# EAGLE design tinyogx360 (EAGLE 9.6.2)
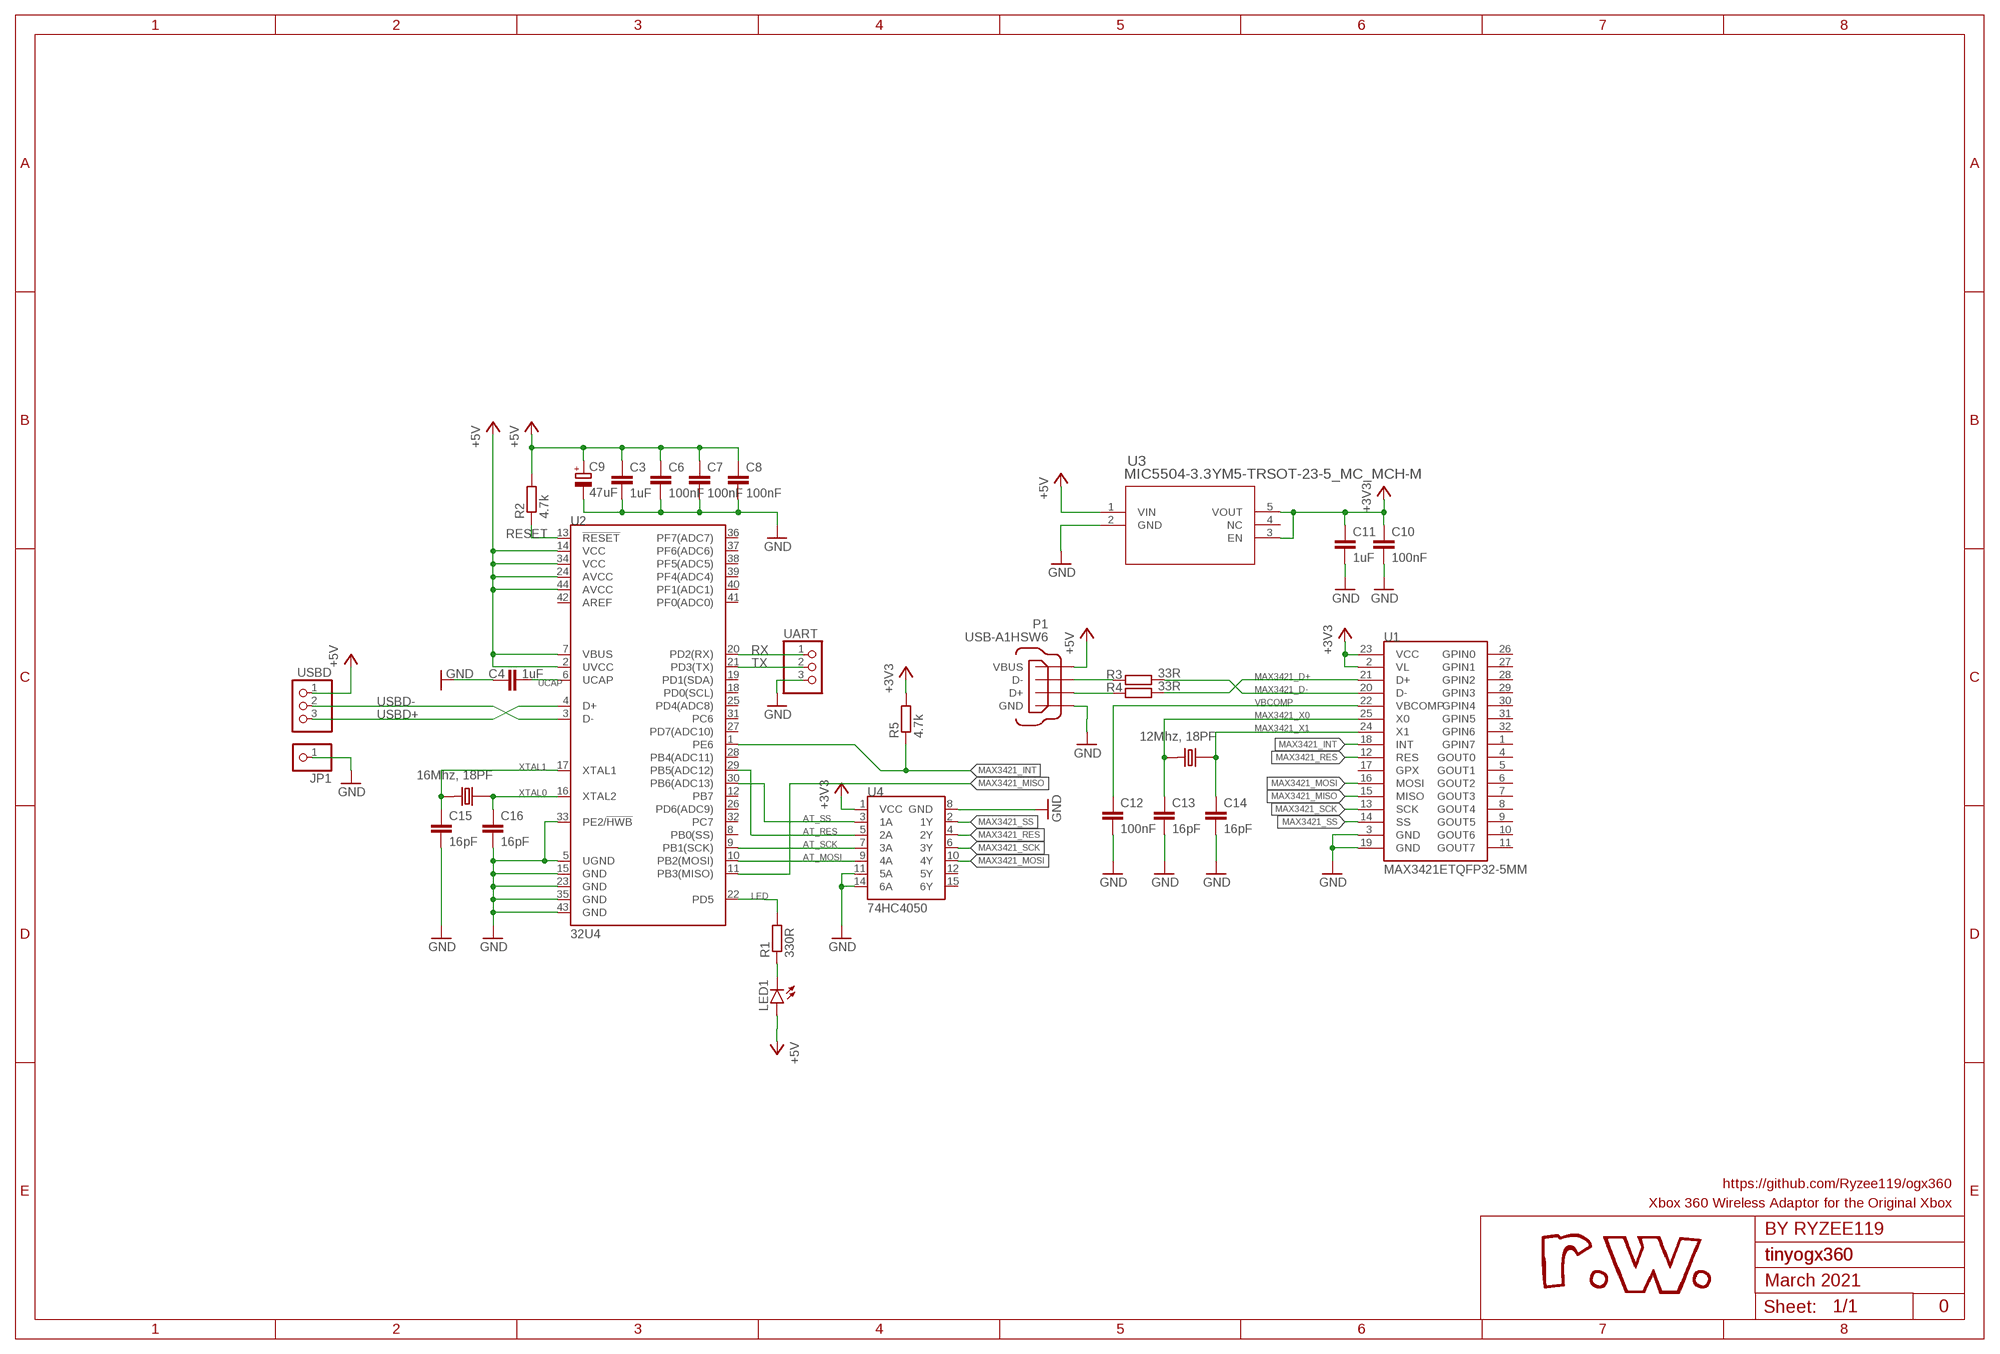
[diagram p0: schematic, sheet 1]

## Parts
C3  1uF  C-EUC0805K  [C0805K]
C4  1uF  C-EUC0805K  [C0805K]
C6  100nF  C-EUC0603K  [C0603K]
C7  100nF  C-EUC0603K  [C0603K]
C8  100nF  C-EUC0603K  [C0603K]
C9  47uF  CPOL-EU153CLV-0505  [153CLV-0505]
C10  100nF  C-EUC0603K  [C0603K]
C11  1uF  C-EUC0805K  [C0805K]
C12  100nF  C-EUC0603K  [C0603K]
C13  16pF  C-EUC0603K  [C0603K]
C14  16pF  C-EUC0603K  [C0603K]
C15  16pF  C-EUC0603K  [C0603K]
C16  16pF  C-EUC0603K  [C0603K]
JP1  PINHD-1X1  [1X01]
LED1  LEDCHIPLED_0603  [CHIPLED_0603]
P1  USB-A1HSW6  [OST_USB-A1HSW6]
R1  330R  R-EU_R0603  [R0603]
R2  4.7k  R-EU_R0603  [R0603]
R3  33R  R-EU_R0603  [R0603]
R4  33R  R-EU_R0603  [R0603]
R5  4.7k  R-EU_R0603  [R0603]
U1  MAX3421ETQFP32-5MM  [TQFP32-5X5MM]
U2  32U4  ATMEGA32U4TQFP-44  [TQFP44]
U3  MIC5504-3.3YM5-TRSOT-23-5_MC_MCH-M  [SOT-23-5_MC_MCH-M]
U4  74HC4050  HEX_CONVERTER  [SO16]
UART  PINHD-1X3  [1X03]
USBD  PINHD-1X3  [1X03]
Y1  12Mhz, 18PF  ECS-250-18-5PX-JEM-TR  [XTAL_ECS-250-18-5PX-JEM-TR]
Y2  16Mhz, 18PF  ECS-250-18-5PX-JEM-TR  [XTAL_ECS-250-18-5PX-JEM-TR]

## Nets
+3V3: C10.1 C11.1 R5.2 U1.2(VL) U1.23(VCC) U3.3(EN) U3.5(VOUT) U4.1(VCC)
+5V: C3.1 C6.1 C7.1 C8.1 C9.+ LED1.A P1.1(VBUS) R2.2 U2.2(UVCC) U2.7(VBUS) U2.14(VCC) U2.24(AVCC) U2.34(VCC) U2.44(AVCC) U3.1(VIN) USBD.1
AT_MOSI: U2.10(PB2(MOSI)) U4.9(4A)
AT_RES: U2.29(PB5(ADC12)) U4.5(2A)
AT_SCK: U2.9(PB1(SCK)) U4.7(3A)
AT_SS: U2.30(PB6(ADC13)) U4.3(1A)
GND: C3.2 C4.1 C6.2 C7.2 C8.2 C9.- C10.2 C11.2 C12.2 C13.2 C14.2 C15.2 C16.2 JP1.1 P1.4(GND) U1.3(GND) U1.19(GND) U2.5(UGND) U2.15(GND) U2.23(GND) U2.33(PE2/!HWB) U2.35(GND) U2.43(GND) U3.2(GND) U4.8(GND) U4.11(5A) U4.14(6A) UART.3
LED: R1.2 U2.22(PD5)
MAX3421_D+: R4.2 U1.21(D+)
MAX3421_D-: R3.2 U1.20(D-)
MAX3421_INT: R5.1 U1.18(INT) U2.1(PE6)
MAX3421_MISO: U1.15(MISO) U2.11(PB3(MISO))
MAX3421_MOSI: U1.16(MOSI) U4.10(4Y)
MAX3421_RES: U1.12(RES) U4.4(2Y)
MAX3421_SCK: U1.13(SCK) U4.6(3Y)
MAX3421_SS: U1.14(SS) U4.2(1Y)
MAX3421_X0: C13.1 U1.25(X0) Y1.2
MAX3421_X1: C14.1 U1.24(X1) Y1.1
N$9: P1.2(D-) R3.1
N$10: P1.3(D+) R4.1
N$14: LED1.C R1.1
RESET: R2.1 U2.13(!RESET)
RX: U2.20(PD2(RX)) UART.1
TX: U2.21(PD3(TX)) UART.2
UCAP: C4.2 U2.6(UCAP)
USBD+: U2.4(D+) USBD.3
USBD-: U2.3(D-) USBD.2
VBCOMP: C12.1 U1.22(VBCOMP)
XTAL0: C16.1 U2.16(XTAL2) Y2.1
XTAL1: C15.1 U2.17(XTAL1) Y2.2
Unconnected: U1.1(GPIN7) U1.4(GOUT0) U1.5(GOUT1) U1.6(GOUT2) U1.7(GOUT3) U1.8(GOUT4) U1.9(GOUT5) U1.10(GOUT6) U1.11(GOUT7) U1.17(GPX) U1.26(GPIN0) U1.27(GPIN1) U1.28(GPIN2) U1.29(GPIN3) U1.30(GPIN4) U1.31(GPIN5) U1.32(GPIN6) U2.8(PB0(SS)) U2.12(PB7) U2.18(PD0(SCL)) U2.19(PD1(SDA)) U2.25(PD4(ADC8)) U2.26(PD6(ADC9)) U2.27(PD7(ADC10)) U2.28(PB4(ADC11)) U2.31(PC6) U2.32(PC7) U2.36(PF7(ADC7)) U2.37(PF6(ADC6)) U2.38(PF5(ADC5)) U2.39(PF4(ADC4)) U2.40(PF1(ADC1)) U2.41(PF0(ADC0)) U2.42(AREF) U3.4(NC) U4.12(5Y) U4.15(6Y)

## Notes on the sheet
- https://github.com/Ryzee119/ogx360
- Xbox 360 Wireless Adaptor for the Original Xbox
- BY RYZEE119
- tinyogx360
- March 2021
- 0

## Library data of the parts
C3 C4 C6-C8 C10-C16 = rcl:C-EU: CAPACITOR, European symbol; SPICEPREFIX: C
C9 = rcl:CPOL-EU: POLARIZED CAPACITOR, European symbol; SPICEPREFIX: C
JP1 = pinhead:PINHD-1X1: PIN HEADER
LED1 = led:LED: LED OSRAM: - CHIPLED LG R971, LG N971, LY N971, LG Q971, LY Q971, LO R971, LY R971 LH N974, LH R974 LS Q976, LO Q976, LY Q976 LO Q996 - Hyper CHIPLED LW Q18S LB Q993, LB Q99A, LB R99A - SideLED LS A670, LO A670, LY A670, LG A670, LP A670 LB A673, LV A673, LT A673, LW A673 LH A674 LY A675 LS A676, LA A676, LO A676, LY A676, LW A676 LS A679, LY A679, LG A679 - Hyper Micro SIDELED® LS Y876, LA Y876, LO Y876, LY Y876 LT Y87S - SmartLED LW L88C, LW L88S LB L89C, LB L89S, LG L890 LS L89K, LO L89K, LY L89K LS L896, LA L896, LO L896, LY L896 - TOPLED LS T670, LO T670, LY T670, LG T670, LP T670 LSG T670, LSP T670, LSY T670, LOP T670, LYG T670 LG T671, LOG T671, LSG T671 LB T673, LV T673, LT T673, LW T673 LH T674 LS T676, LA T676, LO T676, LY T676, LB T676, LH T676, LSB T676, LW T676 LB T67C, LV T67C, LT T67C, LS T67K, LO T67K, LY T67K, LW E67C LS E67B, LA E67B, LO E67B, LY E67B, LB E67C, LV E67C, LT E67C LW T67C LS T679, LY T679, LG T679 LS T770, LO T770, LY T770, LG T770, LP T770 LB T773, LV T773, LT T773, LW T773 LH T774 LS E675, LA E675, LY E675, LS T675 LS T776, LA T776, LO T776, LY T776, LB T776 LHGB T686 LT T68C, LB T68C - Hyper Mini TOPLED® LB M676 - Mini TOPLED Santana® LG M470 LS M47K, LO M47K, LY M47K Source: http://www.osram.convergy.de LUXEON: - LUMILED® LXK2-PW12-R00, LXK2-PW12-S00, LXK2-PW14-U00, LXK2-PW14-V00 LXK2-PM12-R00, LXK2-PM12-S00, LXK2-PM14-U00 LXK2-PE12-Q00, LXK2-PE12-R00, LXK2-PE12-S00, LXK2-PE14-T00, LXK2-PE14-U00 LXK2-PB12-K00, LXK2-PB12-L00, LXK2-PB12-M00, LXK2-PB14-N00, LXK2-PB14-P00, LXK2-PB14-Q00 LXK2-PR12-L00, LXK2-PR12-M00, LXK2-PR14-Q00, LXK2-PR14-R00 LXK2-PD12-Q00, LXK2-PD12-R00, LXK2-PD12-S00 LXK2-PH12-R00, LXK2-PH12-S00 LXK2-PL12-P00, LXK2-PL12-Q00, LXK2-PL12-R00 Source: www.luxeon.com KINGBRIGHT: KA-3528ASYC Source: www.kingbright.com
P1 = my-library:USB-A1HSW6: USB - A Receptacle Connector 4 Position Through Hole, Right Angle; DESCRIPTION: USB-A (USB TYPE-A) Receptacle Connector 4 Position Through Hole, Right Angle; DIGI-KEY_PART_NUMBER: ED2989-ND; MF: On Shore; MP: USB-A1HSW6; PACKAGE: None; PURCHASE-URL: https://pricing.snapeda.com/search/part/USB-A1HSW6/?ref=eda
R1-R5 = rcl:R-EU_: RESISTOR, European symbol; SPICEPREFIX: R
U1 = my-library:MAX3421E: USB Peripheral/Host Controller w/ SPI
U2 = SparkFun-IC-Microcontroller:ATMEGA32U4: Atmel MCU, 32KByte Atmel 44-pin 8-bit Microcontroller with 32KBytes of ISP Flash and USB Controller Datasheet <http://cdn.sparkfun.com/datasheets/Dev/Arduino/Boards/ATMega32U4.pdf> SparkFun Products LilyPad Arduino USB - ATmega32U4 Board <https://www.sparkfun.com/products/12049> (DEV-12049) Pro Micro - 5V/16MHz <https://www.sparkfun.com/products/12640> (DEV-12640) Pro Micro - 3.3V/8MHz <https://www.sparkfun.com/products/12587> (DEV-12587) Fio v3 - ATmega32U4 <https://www.sparkfun.com/products/11520> (DEV-11520) Qduino Mini <https://www.sparkfun.com/products/13614> (DEV-13614) Makey Makey - Standard Kit <https://www.sparkfun.com/products/11511> (WIG-11511) Makey Makey Deluxe Kit <https://www.sparkfun.com/products/11519> (WIG-11519); PROD_ID: IC-11161
U3 = my-library:MIC5504-3.3YM5-TR; BUILT_BY: EMA_Jessica; COPYRIGHT: Copyright (C) 2018 Accelerated Designs. All rights reserved; MANUFACTURER_PART_NUMBER: MIC5504-3.3YM5-TR; SOURCELIBRARY: Microchip_2019-08-23_21; VENDOR: Microchip
U4 = SparkFun-IC-Comms:HEX_CONVERTER: 74HC4050 Hex Buffer 74HC4050 Hex Buffer Level Shifter SMD SO016 SparkFun Products CAN-BUS Shield <https://www.sparkfun.com/products/13262> (DEV-13262) SparkFun MP3 Player Shield <https://www.sparkfun.com/products/12660> (DEV-12660) SparkFun microSD Shield <https://www.sparkfun.com/products/12761> (DEV-12761) SparkFun USB Host Shield <https://www.sparkfun.com/products/9947> (DEV-09947); PROD_ID: IC-09604
UART USBD = pinhead:PINHD-1X3: PIN HEADER
Y1 Y2 = my-library:ECS-250-18-5PX-JEM-TR: CRYSTAL SMD; DESCRIPTION: 25MHz ±20ppm Crystal 18pF 30 Ohms HC-49/US; DIGI-KEY_PART_NUMBER: XC2083CT-ND; MF: ECS Inc.; MP: ECS-250-18-5PX-JEM-TR; PACKAGE: HC49/US ECS International; PURCHASE-URL: https://pricing.snapeda.com/search/part/ECS-250-18-5PX-JEM-TR/?ref=eda

## Board
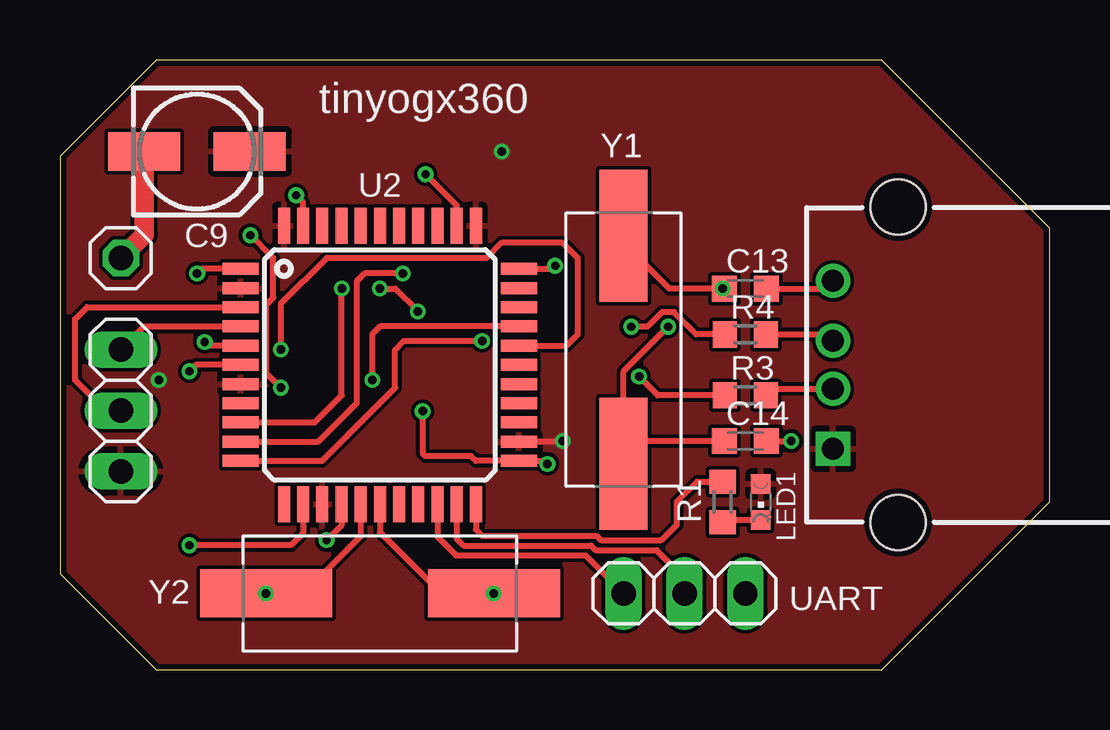
[diagram p1: board, top side]
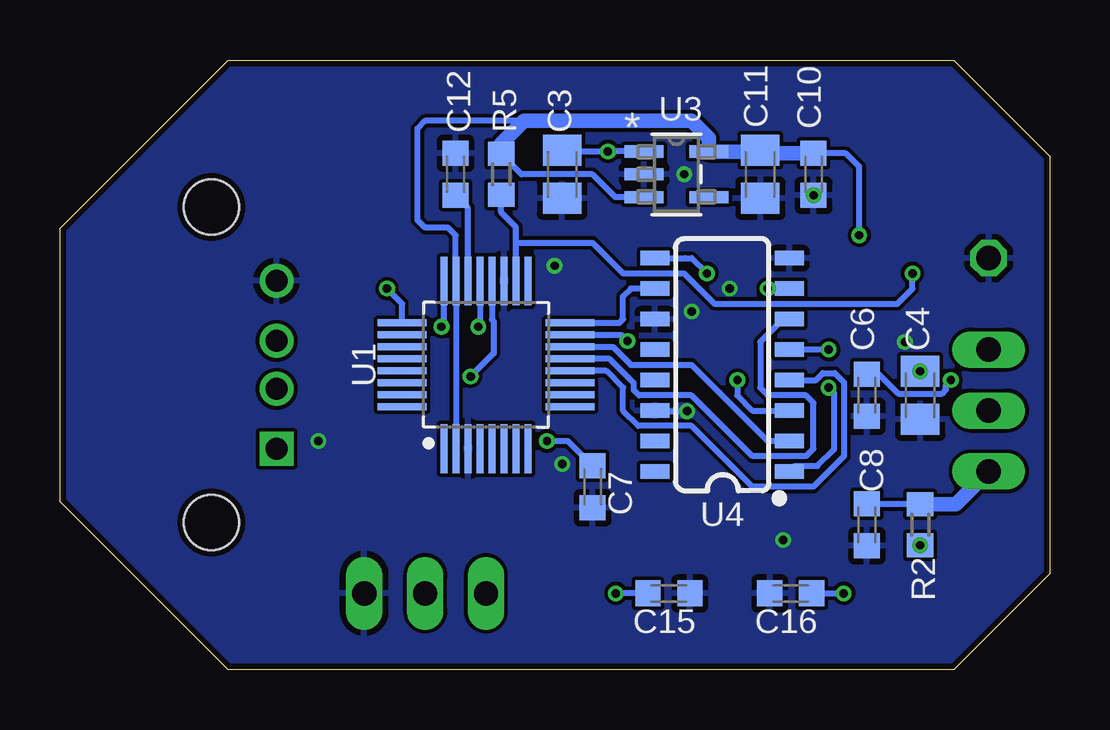
[diagram p2: board, bottom side, seen from below]

Size 41.26 x 25.4 mm. Coordinates in mm from the lower left corner, seen from the top.
Outline: 0,21.4 0,4 4,0 34.26,0 41.26,7 41.26,18.4 34.26,25.4 4,25.4 0,21.4
Copper layers (1*16): Top 0.035mm / dielectric 1.5mm / Bottom 0.035mm
Design rules "Elecrow_2-layer_eagle_rule": minimum track width 6mil, minimum drill 12mil, track to track 6mil, track to pad 6mil, pad to pad 6mil, via to via 6mil, smd to smd 0mil, copper to edge 10mil, drill to drill 10mil, minimum pad ring 10mil, minimum via ring 6mil, stop-mask expansion 2mil, vias tented up to drill 100mil, thermal gap 10mil

### Footprints (pad centres in the part's own frame; a part is rotated, then mirrored left to right if it is on the bottom)
C0805K = smd 1.3 x 1.6: 1 -1,0; 2 1,0
C0603K = smd 1.05 x 1.08: 1 -0.875,0; 2 0.875,0
153CLV-0505 = smd 3 x 1.6: + 2.2,0; - -2.2,0
1X01 = drill 1.016 octagon: 1 0,0
CHIPLED_0603 = smd 0.8 x 0.8: A 0,-0.75; C 0,0.75
OST_USB-A1HSW6 = drill 0.92 square: 1 -3.5,6.51 | drill 0.92: 2 -1,6.51; 3 1,6.51; 4 3.5,6.51 | hole 2.3: -6.57,3.8; 6.57,3.8
R0603 = smd 1 x 1.1: 1 -0.85,0; 2 0.85,0
TQFP32-5X5MM = smd 2.032 x 0.28: 1 -3.496,1.75; 2 -3.496,1.25; 3 -3.496,0.75; 4 -3.496,0.25; 5 -3.496,-0.25; 6 -3.496,-0.75; 7 -3.496,-1.25; 8 -3.496,-1.75; 17 3.496,-1.75; 18 3.496,-1.25; 19 3.496,-0.75; 20 3.496,-0.25; 21 3.496,0.25; 22 3.496,0.75; 23 3.496,1.25; 24 3.496,1.75 | smd 0.28 x 2.032: 9 -1.75,-3.496; 10 -1.25,-3.496; 11 -0.75,-3.496; 12 -0.25,-3.496; 13 0.25,-3.496; 14 0.75,-3.496; 15 1.25,-3.496; 16 1.75,-3.496; 25 1.75,3.496; 26 1.25,3.496; 27 0.75,3.496; 28 0.25,3.496; 29 -0.25,3.496; 30 -0.75,3.496; 31 -1.25,3.496; 32 -1.75,3.496
TQFP44 = smd 1.5 x 0.5: 1 -5.8,4; 2 -5.8,3.2; 3 -5.8,2.4; 4 -5.8,1.6; 5 -5.8,0.8; 6 -5.8,0; 7 -5.8,-0.8; 8 -5.8,-1.6; 9 -5.8,-2.4; 10 -5.8,-3.2; 11 -5.8,-4; 23 5.8,-4; 24 5.8,-3.2; 25 5.8,-2.4; 26 5.8,-1.6; 27 5.8,-0.8; 28 5.8,0; 29 5.8,0.8; 30 5.8,1.6; 31 5.8,2.4; 32 5.8,3.2; 33 5.8,4 | smd 0.5 x 1.5: 12 -4,-5.8; 13 -3.2,-5.8; 14 -2.4,-5.8; 15 -1.6,-5.8; 16 -0.8,-5.8; 17 0,-5.8; 18 0.8,-5.8; 19 1.6,-5.8; 20 2.4,-5.8; 21 3.2,-5.8; 22 4,-5.8; 34 4,5.8; 35 3.2,5.8; 36 2.4,5.8; 37 1.6,5.8; 38 0.8,5.8; 39 0,5.8; 40 -0.8,5.8; 41 -1.6,5.8; 42 -2.4,5.8; 43 -3.2,5.8; 44 -4,5.8
SOT-23-5_MC_MCH-M = smd 1.626 x 0.508: 1 -1.346,0.95; 2 -1.346,0; 3 -1.346,-0.95; 4 1.346,-0.95; 5 1.346,0.95
SO16 = smd 0.6 x 1.2: 1 -4.445,-2.8; 2 -3.175,-2.8; 3 -1.905,-2.8; 4 -0.635,-2.8; 5 0.635,-2.8; 6 1.905,-2.8; 7 3.175,-2.8; 8 4.445,-2.8; 9 4.445,2.8; 10 3.175,2.8; 11 1.905,2.8; 12 0.635,2.8; 13 -0.635,2.8; 14 -1.905,2.8; 15 -3.175,2.8; 16 -4.445,2.8
1X03 = drill 1.016 long: 1 -2.54,0; 2 0,0; 3 2.54,0
XTAL_ECS-250-18-5PX-JEM-TR = smd 5.5 x 2: 1 -4.75,0; 2 4.75,0

### Placement (x,y rotation side)
C3  20.32,20.64 270 bottom
C4  5.4,11.43 90 bottom
C6  7.62,11.43 270 bottom
C7  19.05,7.62 270 bottom
C8  7.62,6.03 270 bottom
C9  5.71,21.59 0 top
C10  9.84,20.64 270 bottom
C11  12.06,20.64 270 bottom
C12  24.77,20.64 90 bottom
C13  28.57,15.88 0 top
C14  28.57,9.53 0 top
C15  15.88,3.17 0 bottom
C16  10.79,3.17 180 bottom
JP1  2.54,17.14 0 top
LED1  29.21,6.99 180 top
P1  38.73,12.7 90 top
R1  27.62,6.99 90 top
R2  5.4,6.03 90 bottom
R3  28.57,11.43 180 top
R4  28.57,13.97 180 top
R5  22.86,20.64 90 bottom
U1  23.5,12.7 90 bottom
U2  13.34,12.7 0 top
U3  15.56,20.64 0 bottom
U4  13.65,12.7 90 bottom
UART  26.04,3.17 0 top
USBD  2.54,10.79 90 top
Y1  23.5,13.34 90 top
Y2  13.34,3.17 0 top

### Tracks (layer width: path | path; a pad name or v marks a point on that pad's centre or on a via)
+3V3  (via drill 0.35)
  Top 0.254: v9.21,11.75 8.6,12.35 8.6,15.21 8.89,15.5 8.89,17.14 v7.94,18.1
  Bottom 0.254: U3.3 18.1,19.69 19.05,20.64 22.01,20.64 R5.2 | U1.2 U1.23 24.77,16.22 24.77,18.1 25.08,18.41 26.04,18.41 26.35,18.73 26.35,22.54 26.04,22.86 21.59,22.86 | U4.1 10.62,8.48 9.67,8.48 8.98,9.18 8.98,11.52 v9.21,11.75 | v7.94,18.1 7.94,20.95 8.49,21.51 C10.1
  Bottom 0.61: C10.1 11.94,21.51 C11.1 12.12,21.59 U3.5 14.21,22.15 14.92,22.86 17.78,22.86 21.59,22.86 21.91,22.86 22.86,21.91 22.86,21.59 R5.2
+5V  (via drill 0.35)
  Top 0.254: v20.95,9.53 20.93,9.5 U2.24
  Bottom 0.254: R2.2 7.59,6.88 C8.1 | U3.1 v18.41,21.59 20.27,21.59 C3.1 | C7.1 20.08,9.53 v20.95,9.53 | C6.1 7.12,12.3 6.31,11.5 4.48,11.5 4.32,11.66 4.32,11.87 v4.12,12.06
  Bottom 0.61: R2.2 3.91,6.88 USBD.1
  pour Top: 0,27.94 44.45,27.94 44.45,-1.27 -1.27,-1.27 -1.27,27.94
AT_MOSI  (via drill 0.35)
  Top 0.254: v14.29,16.51 12.7,16.51 12.38,16.19 12.38,11.11 10.77,9.5 U2.10
  Bottom 0.254: U4.9 15.18,17.14 14.92,17.14 v14.29,16.51
AT_RES  (via drill 0.35)
  Top 0.254: v9.21,13.34 9.21,15.24 11.11,17.14 17.14,17.14 17.78,17.14 18.41,17.78 20.95,17.78 21.59,17.14 21.59,13.97 21.12,13.5 U2.29
  Bottom 0.254: v9.21,13.34 U4.5
AT_SCK  (via drill 0.35)
  Top 0.254: v11.75,15.88 11.75,11.43 10.62,10.3 U2.9
  Bottom 0.254: U4.7 v11.75,15.88
AT_SS  (via drill 0.35)
  Top 0.254: U2.30 13.35,14.3 13.02,13.97 v13.02,12.06
  Bottom 0.254: v13.02,12.06 13.02,11.43 12.38,10.79 U4.3
GND  (via drill 0.35)
  Top 0.254: U2.15 11.73,6.02 v11.11,5.4 | U2.35 16.54,19.34 v15.24,20.64 | v15.12,10.77 15.12,9.01 15.24,8.89 17.14,8.89 17.34,8.7 U2.23 20.19,8.7 v20.32,8.57 | U2.33 20.51,16.7 v20.64,16.83 | C14.2 v30.48,9.53 | C13.2 31.9,15.88 P1.4 | U2.5 6.18,13.5 v6.03,13.65 | U2.43 10.13,19.47 C10.2 | v13.34,15.88 13.97,15.88 v14.92,14.92
  Top 0.813: JP1.1 3.52,18.12 C9.-
  Bottom 0.254: U4.14 16.42,10.77 v15.12,10.77
  other vias: 9.84,19.76
  pour Bottom: -2.54,30.48 46.99,30.48 46.99,-1.27 -2.54,-1.27
LED
  Top 0.254: R1.2 26.57,7.83 25.72,6.99 25.72,6.03 25.08,5.4 22.54,5.4 22.38,5.56 22.36,5.58 17.6,5.58 17.34,5.84 U2.22
MAX3421_D+  (via drill 0.35)
  Top 0.254: R4.2 26.53,13.97 25.6,14.89 25.1,14.89 24.49,14.29 v23.81,14.29
  Bottom 0.254: U1.21 23.75,14.36 v23.81,14.29
MAX3421_D-  (via drill 0.35)
  Top 0.254: R3.2 24.92,11.43 v24.14,12.22
  Bottom 0.254: v24.14,12.22 23.18,13.18 23.18,14.51 23.25,14.58 U1.20
MAX3421_INT  (via drill 0.35)
  Top 0.254: U2.1 5.91,16.7 v5.71,16.51
  Bottom 0.254: R5.1 22.86,19.05 22.25,18.43 22.25,17.78 | U1.18 22.25,17.78 | v5.71,16.51 5.71,15.88 6.35,15.24 13.97,15.24 15.24,16.51 17.78,16.51 19.05,17.78 22.25,17.78
MAX3421_MISO  (via drill 0.35)
  Top 0.254: U2.11 10.92,8.7 13.97,11.75 13.97,13.34 14.33,13.69 v17.6,13.69
  Bottom 0.254: U1.15 17.85,13.95 v17.6,13.69
MAX3421_MOSI
  Bottom 0.254: U4.10 17.46,15.88 17.78,15.56 17.78,14.61 17.93,14.45 19.05,14.45 U1.16
MAX3421_RES
  Bottom 0.254: U1.12 18.48,12.45 17.78,11.75 17.78,10.79 17.14,10.16 14.92,10.16 12.38,7.62 9.84,7.62 8.57,8.89 8.57,11.97 8.96,12.35 9.46,12.35 9.75,12.06 U4.4
MAX3421_SCK
  Bottom 0.254: U1.13 18.35,12.95 17.33,11.93 17.33,11.65 17.11,11.43 14.92,11.43 12.38,8.89 10.16,8.89 9.84,9.21 9.84,11.11 10.16,11.43 11.75,11.43 12.06,11.75 12.06,13.65 11.11,14.61 U4.6
MAX3421_SS
  Bottom 0.254: U4.2 11.75,9.53 14.92,12.7 17.46,12.7 18.21,13.45 U1.14
MAX3421_X0  (via drill 0.35)
  Top 0.254: C13.1 v27.62,15.88 25.4,15.88 23.5,17.78 Y1.2
  Bottom 0.254: U1.25 26.99,15.24 v27.62,15.88
MAX3421_X1  (via drill 0.35)
  Top 0.254: C14.1 24.43,9.53 Y1.1 23.5,12.43 v25.35,14.29
  Bottom 0.254: v25.35,14.29 25.25,14.39 U1.24
N$9
  Top 0.254: R3.1 29.7,11.7 P1.2
N$10
  Top 0.254: R4.1 31.95,13.97 P1.3
N$14
  Top 0.254: R1.1 27.72,6.24 LED1.C
RESET  (via drill 0.35)
  Top 0.254: U2.13 10.13,5.69 9.63,5.18 R2.1
  other vias: 5.4,5.18
RX
  Top 0.254: U2.20 15.73,5.54 16.51,4.76 21.91,4.76 UART.1
TX
  Top 0.254: U2.21 16.54,6.35 16.54,6.01 16.54,5.46 16.83,5.17 22.14,5.17 22.33,4.98 24.87,4.98 26.04,3.81 | 26.04,3.81 26.04,3.49 | 26.04,3.49 UART.2 | 26.04,3.81 26.04,3.49
UCAP  (via drill 0.35)
  Top 0.254: U2.6 5.67,12.7 C4.2
  other vias: 5.4,12.43
USBD+
  Top 0.254: U2.4 7.52,14.29 3.49,14.29 USBD.3
USBD-
  Top 0.254: USBD.2 1.91,10.79 0.64,12.06 0.64,14.61 1.13,15.1 U2.3
VBCOMP
  Bottom 0.254: U1.22 24.25,19.24 C12.1
XTAL0  (via drill 0.35)
  Top 0.254: U2.16 12.54,5.55 10.16,3.17 Y2.1
  Bottom 0.254: C16.1 Y2.1
  other vias: 8.59,3.17
XTAL1  (via drill 0.35)
  Top 0.254: U2.17 13.34,5.71 15.88,3.17 Y2.2
  Bottom 0.254: C15.1 Y2.2
  other vias: 18.09,3.17

### Text on the board
tPlace: tinyogx360